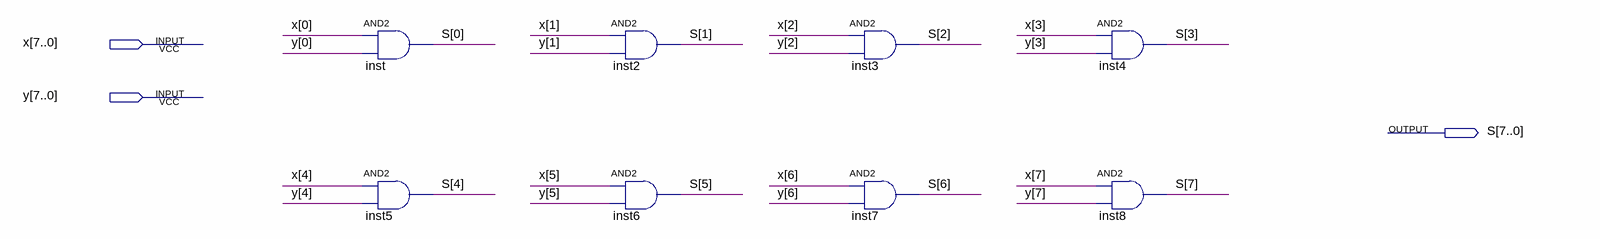
[diagram p0: schematic sheet]
// Quartus schematic AND_ULA.bdf as structural Verilog: 8 symbols, 3 pins
module AND_ULA (
  input  [7:0] x,
  input  [7:0] y,
  output [7:0] S
);

  and inst (S[0], x[0], y[0]);
  and inst5 (S[4], x[4], y[4]);
  and inst2 (S[1], x[1], y[1]);
  and inst6 (S[5], x[5], y[5]);
  and inst3 (S[2], x[2], y[2]);
  and inst7 (S[6], x[6], y[6]);
  and inst4 (S[3], x[3], y[3]);
  and inst8 (S[7], x[7], y[7]);
endmodule
